# Altium schematic sheet FPC-isoJTAG.SchDoc
size A4; SheetNumber: 10; SheetTotal: 15
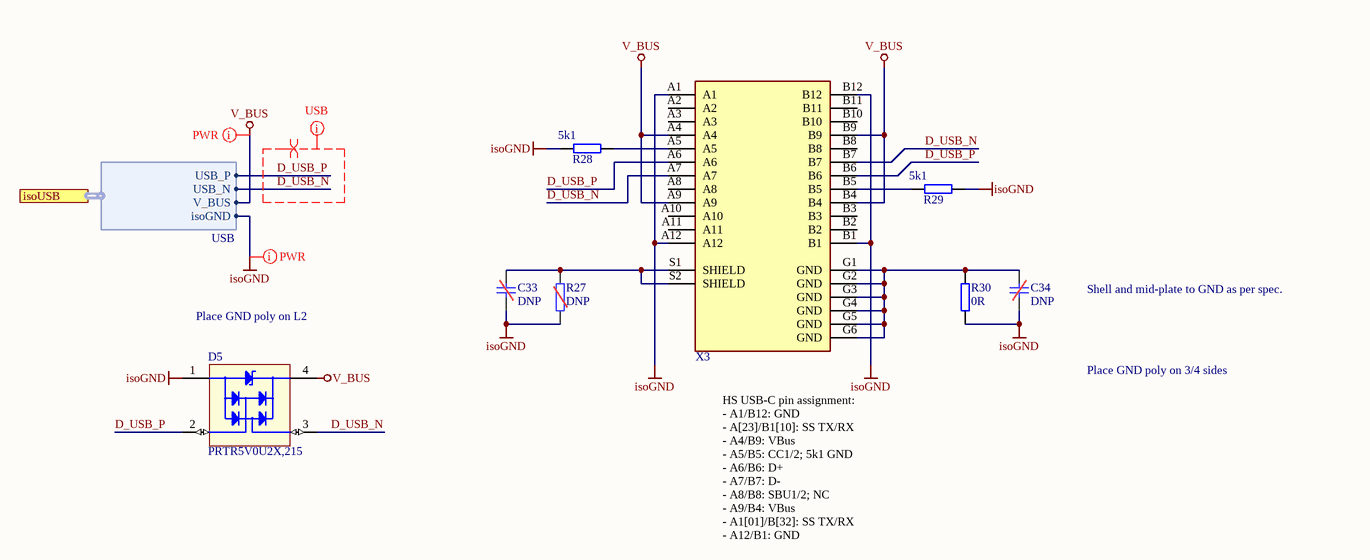
[diagram p0: FPC-isoJTAG.SchDoc]

## Parts
C33  DNP  [C_1206_TE-DNP]  (no BOM)
C34  DNP  [C_1206_TE-DNP]  (no BOM)
D5  PRTR5V0U2X,215  [SOT-143B-4]
R27  DNP  [R_1206_TE-DNP]  (no BOM)
R28  5k1  [R_0603_TE]
R29  5k1  [R_0603_TE]
R30  0R  [R_1206_TE]
X3  (no value)  [AMPHENOL_MUSBRM1C130_CUSTOMPADLEN3.05mm]

## Ports
isoUSB (harness USB)

## Harnesses
USB: USB_P, USB_N, V_BUS, isoGND

## Nets
isoGND: C33.1 C34.1 D5.1(GND) R27.1 R28.1 R29.2 R30.1 X3.A1 X3.A12 X3.B1 X3.B12 ; port isoUSB.isoGND
V_BUS: D5.4(REF) X3.A4 X3.A9 X3.B4 X3.B9 ; port isoUSB.V_BUS
D_USB_N: D5.3(I/O) X3.A7 X3.B7 ; port isoUSB.USB_N
D_USB_P: D5.2(I/O) X3.A6 X3.B6 ; port isoUSB.USB_P
NetC33_2: C33.2 R27.2 X3.S1(SHIELD) X3.S2(SHIELD)
NetC34_2: C34.2 R30.2 X3.G1(GND) X3.G2(GND) X3.G3(GND) X3.G4(GND) X3.G5(GND) X3.G6(GND)
NetR28_2: R28.2 X3.A5
NetR29_1: R29.1 X3.B5

Not connected (* = marked no-connect by the designer): X3 A2 A3 A8 A10 A11 B2 B3 B8 B10 B11

## Layout directives
differential pair: D_USB_N, D_USB_P
net class USB: D_USB_N, D_USB_P
net class PWR: isoGND, V_BUS

## Notes on the sheet
- Shell and mid-plate to GND as per spec.
- Place GND poly on L2
- Place GND poly on 3/4 sides
- HS USB-C pin assignment:
  - A1/B12: GND
  - A[23]/B1[10]: SS TX/RX
  - A4/B9: VBus
  - A5/B5: CC1/2; 5k1 GND
  - A6/B6: D+
  - A7/B7: D-
  - A8/B8: SBU1/2; NC
  - A9/B4: VBus
  - A1[01]/B[32]: SS TX/RX
  - A12/B1: GND
- Title
- Revision:
- Design Engineer:
- Date:
- Project:
- Sheet
- of

## Library data of the parts
C33 C34 = UZgen_C_1206_DNP: Generic capacitor (DNP); Manufacturer: UZgen; Created from: UZgenTool; Manufacturer Part Number: UZgen_C_1206_DNP; PartID: 5814; Created On: 29/03/2025 17:15:00; Value: DNP; Device Package: 1206; Voltage: -; Technology: -; Tolerance: -; Mounting Type: SMD; Last Updated: 02/04/2025 19:05:00
D5 = PRTR5V0U2X,215: ESD Suppressors / TVS Diodes PRTR5V0U2X/SOT143/SOT4; Manufacturer: Nexperia; Type: TVS-Diode; Created from: AGeiger; Manufacturer Part Number: PRTR5V0U2X,215; PartID: 10; Created On: 26.11.2023 17:14:11; ComponentLink1Description: Datasheet; ComponentLink1URL: https://www.mouser.de/datasheet/2/916/PRTR5V0U2X-2938759.pdf; Component Type: TVS Diode, ESD; Device Package: SOT-143B-4; Last Updated: 26.11.2023 17:16:37; Mounting Type: SMD; Operating Temperature: -40 to 85 °C; Supplier 1: Mouser; Supplier Part Number 1: 771-PRTR5V0U2X-T/R; Supplier 2: LCSC; Supplier Part Number 2: C12333; Value: PRTR5V0U2X,215; Live Cycle Status: 1; LCSC Part Number: C12333
R27 = UZgen_R_1206_DNP: Generic resistor (DNP); Manufacturer: UZgen; Created from: UZgenTool; Manufacturer Part Number: UZgen_R_1206_DNP; PartID: 595; Created On: 25/03/2025 14:26:15; Value: DNP; Device Package: 1206; Tolerance: -; Mounting Type: SMD; Last Updated: 02/04/2025 19:05:00
R28 R29 = UZgen_R_0603_5k1: Generic resistor; Manufacturer: UZgen; Tolerance: 1 %; Created from: UZgenTool; Manufacturer Part Number: UZgen_R_0603_5k1; PartID: 238; Created On: 02/07/2024 17:29:50; Value: 5k1; Device Package: 0603; Mounting Type: SMD; Last Updated: 02/07/2024 17:29:50
R30 = UZgen_R_1206_0R: Generic resistor; Manufacturer: UZgen; Tolerance: 1 %; Created from: UZgenTool; Manufacturer Part Number: UZgen_R_1206_0R; PartID: 583; Created On: 08/07/2024 14:34:30; Value: 0R; Device Package: 1206; Mounting Type: SMD; Last Updated: 08/07/2024 14:34:30
X3 = MUSBRM1C1M0: USB Connectors RUGGED TYPE C RIGHT ANGLE; Manufacturer: Amphenol; Created from: FRosner; MF: Amphenol ICC (Commercial Products); Manufacturer Part Number: MUSBRM1C1M0; PartID: 34; Created On: 04/07/2024 09:07:50; ComponentLink1Description: Datasheet; ComponentLink1URL: https://www.mouser.de/datasheet/2/18/2/io_harsh_musb_type_c-3369676.pdf; Last Updated: 02/04/2025 16:50:00; Mounting Type: THT; Operating Temperature: -40 °C to +105 °C; Series: MUSBR; Supplier 1: Mouser; Supplier Part Number 1: 523-MUSBRM1C1M0; Supplier 2: LCSC; Supplier Part Number 2: C3197960; Value: MUSBRM1C1M0; LCSC Part Number: C3197960; MP: MUSBRM1C130; Package: None; Price: None; Availability: Unavailable